# EasyEDA Pro project New Project_2025-11-05_14-04-50.eprj

# Schematic Schematic1
Board Name: Board1; Create Date: 2025-11-05; Page Name: P1; Project Name: New Project_2025-11-05_14-04-50; Schematic Name: Schematic1; Update Date: 2025-11-05; Company: EasyEDA.com; Page Size: A4; Version: V1.0
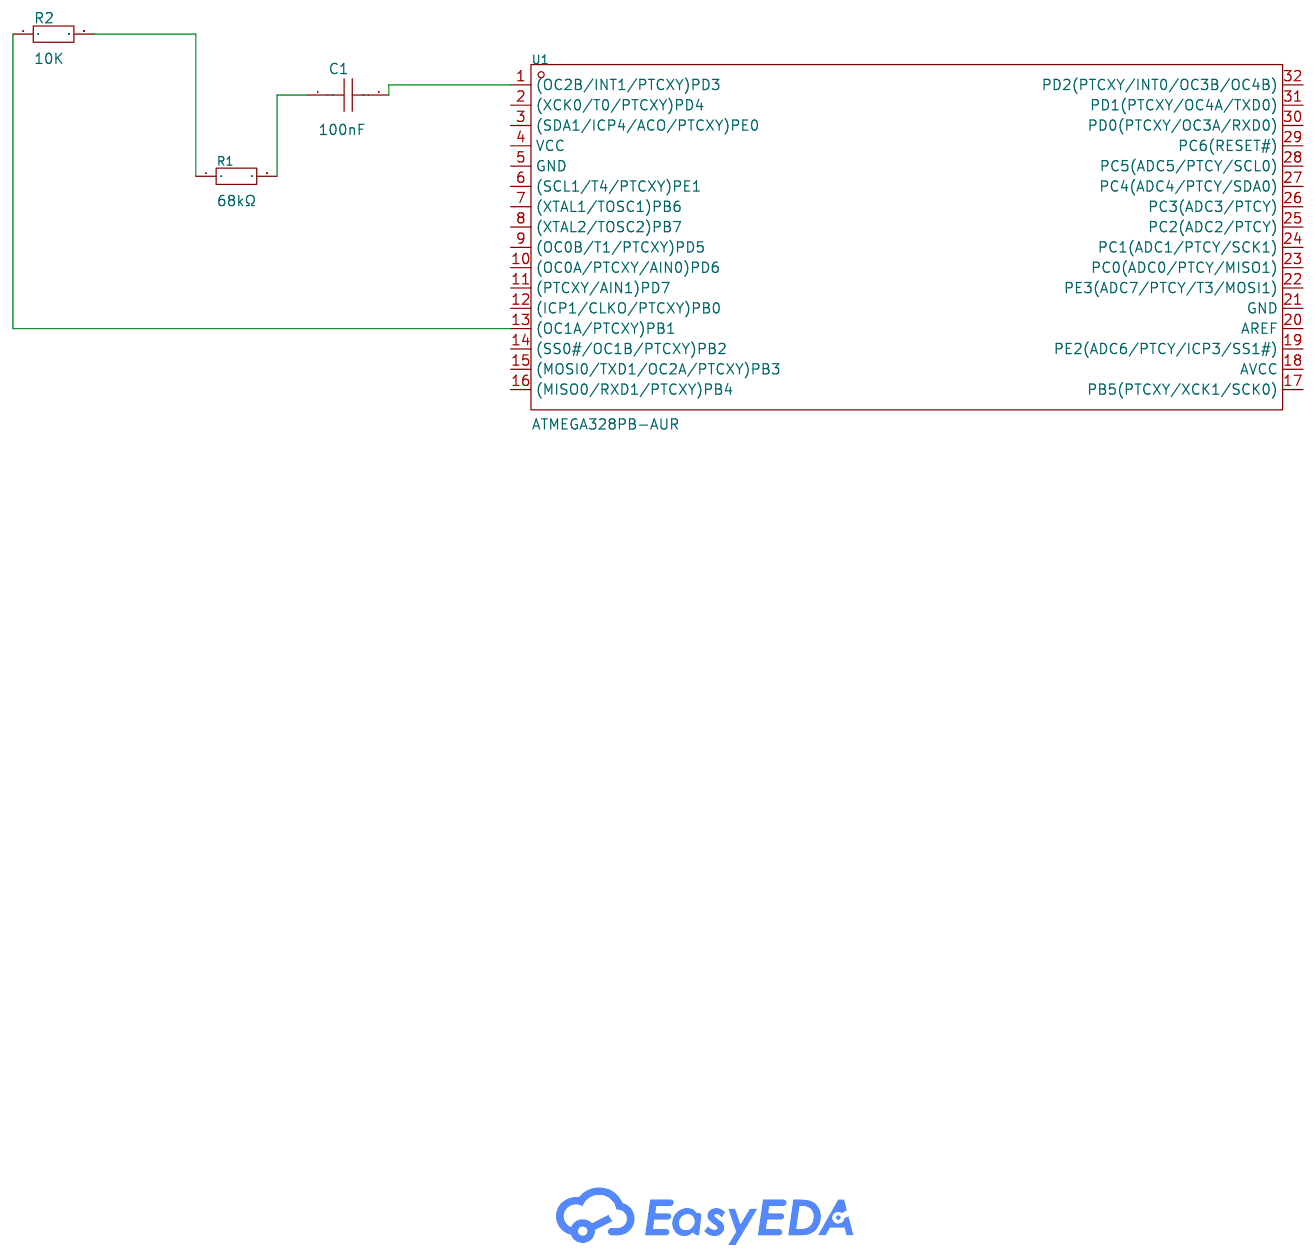
[diagram p0: schematic sheet]

## Parts
C1  100nF  [C0603]
R1  68kΩ  [R0603]
R2  10K  [R0603]
U1  ATMEGA328PB-AUR  [TQFP-32_L7.0-W7.0-P0.80-LS9.0-BL]

## Library data of the parts
C1 = CC0603KRX7R9BB104: LCSC Part Name: 100nF ±10% 50V; Supplier Part: C14663; Manufacturer: YAGEO(国巨); Supplier Footprint: 0603; JLCPCB Part Class: Basic Part; Datasheet: https://item.szlcsc.com/datasheet/CC0603KRX7R9BB104/15331.html; Supplier: LCSC; Tolerance: ±10%; Voltage Rating: 50V; Temperature Coefficient: X7R
R1 = 0603WAF6802T5E: LCSC Part Name: 68kΩ ±1% 100mW 厚膜电阻; Supplier Part: C23231; Manufacturer: UNI-ROYAL(厚声); Supplier Footprint: 0603; JLCPCB Part Class: Basic Part; Datasheet: https://item.szlcsc.com/datasheet/0603WAF6802T5E/23958.html; Supplier: LCSC; Type: Thick Film Resistor; Tolerance: ±1%; Power(Watts): 100mW; Voltage-Supply(Max): 75V; Temperature Coefficient: ±100ppm/℃; Operating Temperature: -55℃~+155℃
R2 = Res_0603: Supplier Footprint: 0603
U1 = ATMEGA328PB-AUR: Supplier Part: C461612; Manufacturer: MICROCHIP(美国微芯); Supplier Footprint: TQFP-32(7x7); JLCPCB Part Class: Extended Part; Datasheet: https://item.szlcsc.com/datasheet/ATMEGA328PB-AUR/466103.html; Supplier: LCSC; CPU Core: AVR; CPU Maximum Speed: 20MHz; Program Storage Size: 32KB; Program Memory Type: FLASH; EEPROM: 1KB; Number of I/O: 27; ADC (Bit): 10bit; Voltage - Supply: 1.8V~5.5V

## Nets
$1N1031: C1.2 U1.1((OC2B/INT1/PTCXY)PD3)
$1N1047: C1.1 R1.2
$1N1101: R1.1 R2.2
$1N1106: R2.1 U1.13((OC1A/PTCXY)PB1)

Not connected (* = marked no-connect by the designer): U1 2((XCK0/T0/PTCXY)PD4) 3((SDA1/ICP4/ACO/PTCXY)PE0) 4(VCC) 5(GND) 6((SCL1/T4/PTCXY)PE1) 7((XTAL1/TOSC1)PB6) 8((XTAL2/TOSC2)PB7) 9((OC0B/T1/PTCXY)PD5) 10((OC0A/PTCXY/AIN0)PD6) 11((PTCXY/AIN1)PD7) 12((ICP1/CLKO/PTCXY)PB0) 14((SS0#/OC1B/PTCXY)PB2) 15((MOSI0/TXD1/OC2A/PTCXY)PB3) 16((MISO0/RXD1/PTCXY)PB4) 17(PB5(PTCXY/XCK1/SCK0)) 18(AVCC) 19(PE2(ADC6/PTCY/ICP3/SS1#)) 20(AREF) 21(GND) 22(PE3(ADC7/PTCY/T3/MOSI1)) 23(PC0(ADC0/PTCY/MISO1)) 24(PC1(ADC1/PTCY/SCK1)) 25(PC2(ADC2/PTCY)) 26(PC3(ADC3/PTCY)) 27(PC4(ADC4/PTCY/SDA0)) 28(PC5(ADC5/PTCY/SCL0)) 29(PC6(RESET#)) 30(PD0(PTCXY/OC3A/RXD0)) 31(PD1(PTCXY/OC4A/TXD0)) 32(PD2(PTCXY/INT0/OC3B/OC4B))

# Board PCB1
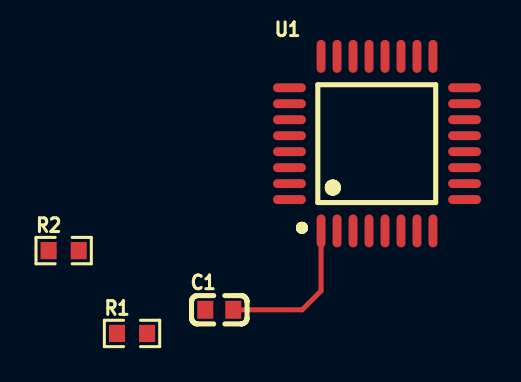
[diagram p1: board, top side]
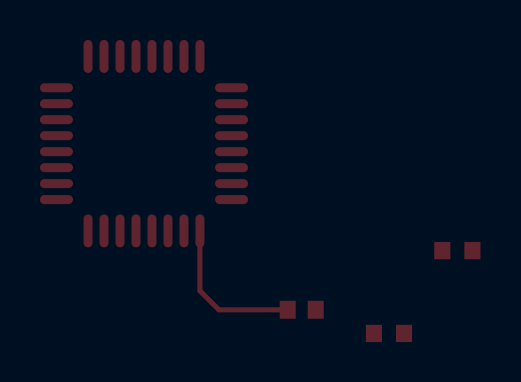
[diagram p2: board, bottom side, seen from below]

No outline. copper layers: Top Layer, Bottom Layer. Coordinates in mm from the lowest, leftmost part position.
Stack: Top Layer 0.035mm / Dielectric1 1.51mm FR4 er 4.5 / Bottom Layer 0.035mm

## Design rules (mm)
template: JLCPCB Capability(Two Layers Board)
spacing copperThickness1oz (default): track to track 0.102, other pairs 0.152 to 0.3
spacing copperThickness2oz: track to track 0.203, other pairs 0.152 to 0.3
track width copperThickness1oz (default): min 0.127, default 0.254, max 2.54
track width copperThickness2oz: min 0.203, default 0.254, max 2.54
differential pair differentialPair (default): width min 0.127, default 0.254, max 2.54; gap min 0.152, default 0.152
via viaSize (default): diameter min 0.5, default 0.61, max 10; hole min 0.3, default 0.305, max 6.3

## Placement (name value [footprint] x y rotation side)
C1  100nF  [C0603]  7.79 1.19 0 top
R1  68kΩ  [R0603]  3.42 0 0 top
R2  10K  [R0603]  0 4.15 0 top
U1  ATMEGA328PB-AUR  [TQFP-32_L7.0-W7.0-P0.80-LS9.0-BL]  15.68 9.5 0 top

## Footprints (pads in the part's own frame, mm; a bottom-side part is the same pattern mirrored in y, then rotated)
C0603
  rect 0.8x0.9 smd: 1(-0.7,0) 2(0.7,0)
R0603
  rect 0.806x0.864 smd: 1(-0.753,0) 2(0.753,0)
TQFP-32_L7.0-W7.0-P0.80-LS9.0-BL
  oval 0.45x1.65 smd: 1(-2.8,-4.369) 2(-2,-4.369) 3(-1.2,-4.369) 4(-0.4,-4.369) 5(0.4,-4.369) 6(1.2,-4.369) 7(2,-4.369) 8(2.8,-4.369) 17(2.8,4.369) 18(2,4.369) 19(1.2,4.369) 20(0.4,4.369) 21(-0.4,4.369) 22(-1.2,4.369) 23(-2,4.369) 24(-2.8,4.369)
  oval 1.65x0.45 smd: 9(4.381,-2.8) 10(4.381,-2) 11(4.381,-1.2) 12(4.381,-0.4) 13(4.381,0.4) 14(4.381,1.2) 15(4.381,2) 16(4.381,2.8) 25(-4.381,2.8) 26(-4.381,2) 27(-4.381,1.2) 28(-4.381,0.4) 29(-4.381,-0.4) 30(-4.381,-1.2) 31(-4.381,-2) 32(-4.381,-2.8)

## Nets
As in the schematic.

Pads without a net: U1 2 3 4 5 6 7 8 9 10 11 12 14 15 16 17 18 19 20 21 22 23 24 25 26 27 28 29 30 31 32

## Routing (per net, layer and track width the routed paths; a pad name or vN(x,y) marks a point on that pad's centre or on a via; arc(x,y) is an arc through that point)
$1N1031: length 7.8
  Top Layer w0.254: C1.2 11.94,1.19 12.88,2.13 U1.1
